# EAGLE design AQS (EAGLE 9.1.3)
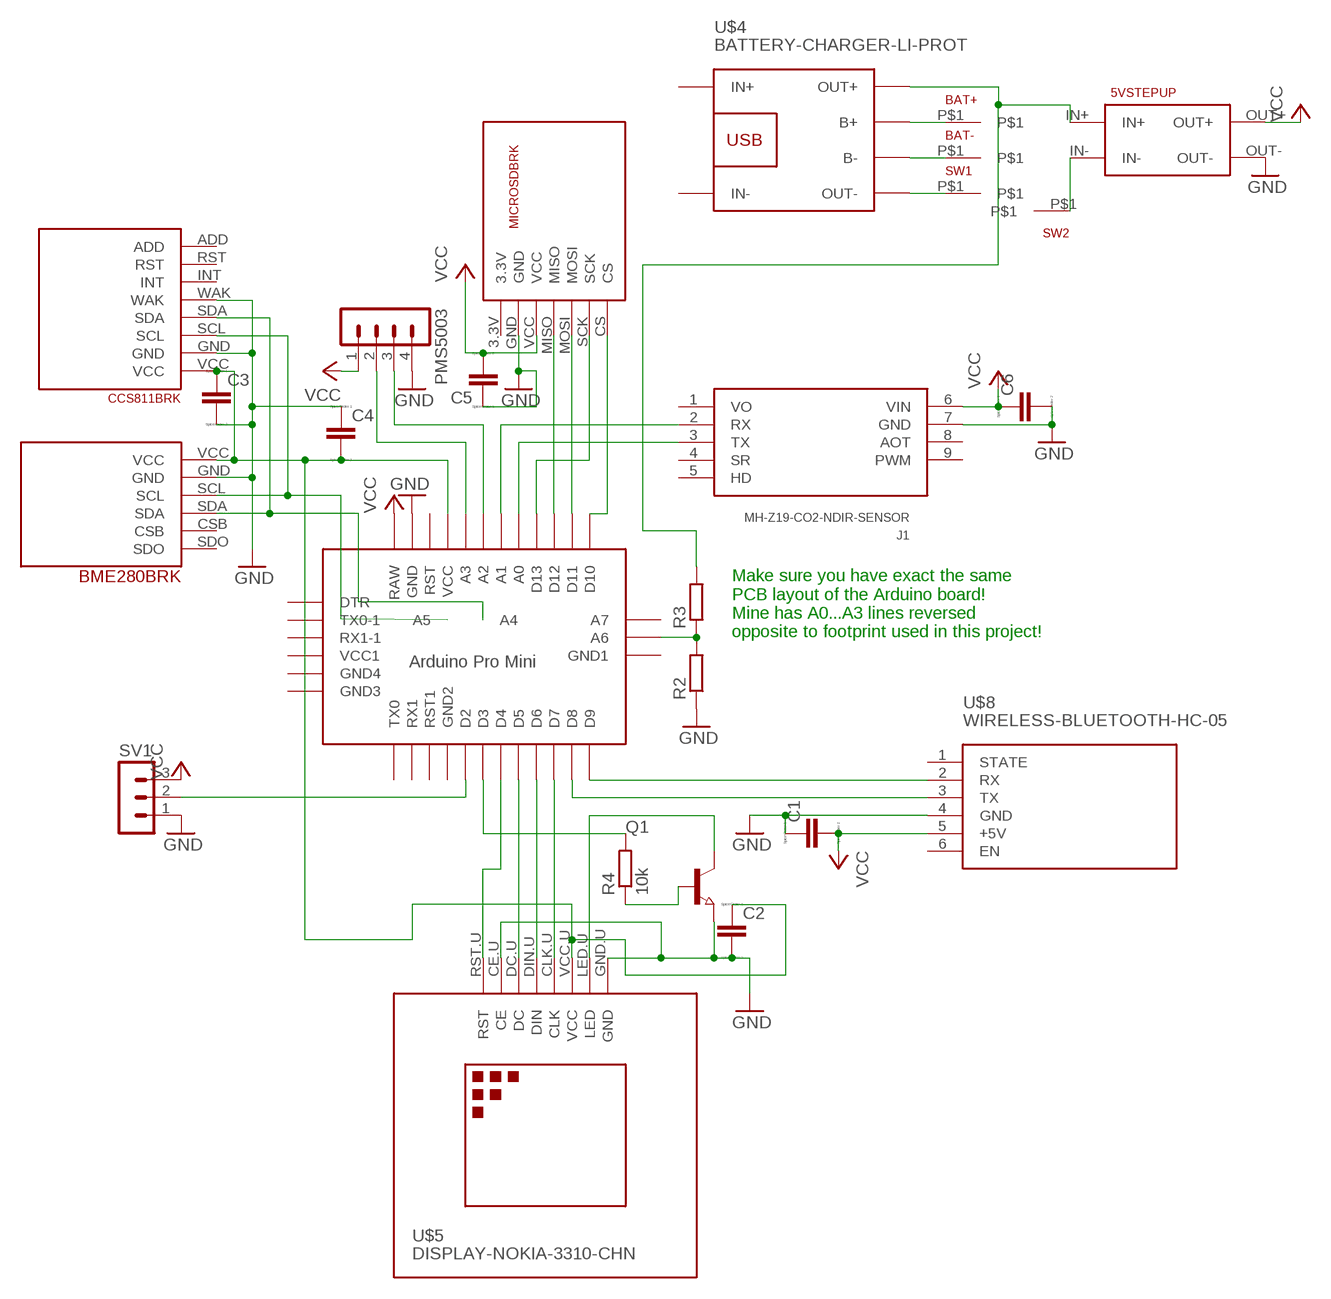
[diagram p0: schematic, sheet 1]

## Parts
BAT+  PIN  [PIN]
BAT-  PIN  [PIN]
C1  CC1206  [C1206]
C2  CC1206  [C1206]
C3  CC1206  [C1206]
C4  CC1206  [C1206]
C5  CC1206  [C1206]
C6  CC1206  [C1206]
J1  MH-Z19-CO2-NDIR-SENSOR  [MH-Z19]
PMS5003  MA04-1  [MA04-1]
Q1  NPN-TRANSISTOR_SOT23  [SOT23]
R2  R-EU_0207/10  [0207/10]
R3  R-EU_0207/10  [0207/10]
R4  10k  R-EU_0207/10  [0207/10]
SV1  MA03-1  [MA03-1]
SW1  PIN  [PIN]
SW2  PIN  [PIN]
U$1  ABK-PRO-MINI  [ABK-PRO-MINI]
U$2  BME280BRK  [BME280BRK]
U$3  5VSTEPUP  [5VSTEPUP]
U$4  BATTERY-CHARGER-LI-PROT  [BATTERY-CHARGER-LI-PROT]
U$5  DISPLAY-NOKIA-3310-CHN  [DISPLAY-NOKIA-3310-CHN]
U$6  CCS811BRK  [CCS811BRK]
U$7  MICROSDBRK  [MICROSDBRK]
U$8  WIRELESS-BLUETOOTH-HC-05  [WIRELESS-BLUETOOTH-HC-05]

## Nets
33V [Power]: C2.1 C3.1 C4.2 U$1.VCC U$2.VCC U$5.VCC.U(VCC) U$6.VCC
GND [Power]: C1.1 C2.2 C3.2 C4.1 C5.1 C6.2 J1.7(GND) PMS5003.4 Q1.2(E) R2.1 SV1.1 U$1.GND U$2.GND U$3.OUT- U$5.CE.U(CE) U$5.GND.U(GND) U$6.GND U$6.WAK U$7.GND U$8.4(GND)
N$1 [Power]: BAT+.P$1 U$4.B+
N$2 [Power]: BAT-.P$1 U$4.B-
N$3: R3.2 U$3.IN+ U$4.OUT+
N$4 [Power]: SW2.P$1 U$3.IN-
N$5 [Signal]: U$1.A4 U$2.SDA U$6.SDA
N$6: U$1.A5 U$2.SCL U$6.SCL
N$7: U$1.D7 U$5.CLK.U(CLK)
N$8: U$1.D6 U$5.DIN.U(DIN)
N$9: U$1.D5 U$5.DC.U(DC)
N$10: U$1.D4 U$5.RST.U(RST)
N$11: Q1.3(C) U$5.LED.U(LED)
N$12: SW1.P$1 U$4.OUT-
N$13: U$1.D9 U$8.2(RX)
N$14: U$1.D10 U$7.CS
N$15: U$1.D11 U$7.MOSI
N$16: U$1.D12 U$7.MISO
N$17: U$1.D13 U$7.SCK
N$18: J1.3(TX) U$1.A0
N$19: J1.2(RX) U$1.A1
N$20: U$1.D8 U$8.3(TX)
N$21: SV1.2 U$1.D2
N$22: PMS5003.3 U$1.A2
N$23: PMS5003.2 U$1.A3
N$24: R2.2 R3.1 U$1.A6
N$25: Q1.1(B) R4.1
N$26: R4.2 U$1.D3
VCC [Power]: C1.2 C5.2 C6.1 J1.6(VIN) PMS5003.1 SV1.3 U$1.RAW U$3.OUT+ U$7.VCC U$8.5(+5V)
Unconnected: J1.4(SR) J1.5(HD) J1.8(AOT) J1.9(PWM) U$1.A7 U$1.DTR U$1.GND1(GND2) U$1.GND2(GND3) U$1.GND3(GND4) U$1.GND4(GND1) U$1.RST U$1.RST1 U$1.RX1 U$1.RX1-1 U$1.TX0 U$1.TX0-1 U$1.VCC1 U$2.CSB U$2.SDO U$4.IN+ U$4.IN- U$6.ADD U$6.INT U$6.RST U$8.1(STATE) U$8.6(EN)

## Notes on the sheet
- Make sure you have exact the same
  PCB layout of the Arduino board! 
  Mine has A0...A3 lines reversed
  opposite to footprint used in this project!

## Power pins joined to a net without a drawn wire
3.3V: U$7.3.3V
VO: J1.1(VO)

## Library data of the parts
BAT+ BAT- SW1 SW2 = AQS:PIN
C1-C6 = eagle-ltspice:C: CAPACITOR, European symbol; SPICEMODEL: NONE; SPICEPREFIX: C
J1 = mg-z19:MH-Z19: MH-Z19 - CO2 NDIR SENSOR
PMS5003 = con-lstb:MA04-1: PIN HEADER; OC_FARNELL: unknown; OC_NEWARK: unknown
Q1 = semicon-smd-ipc:NPN-TRANSISTOR_: NPN TRANSISTOR
R2 R3 = rcl:R-EU_: RESISTOR, European symbol; SPICEPREFIX: R
R4 = resistor:R-EU_: RESISTOR, European symbol
SV1 = con-lstb:MA03-1: PIN HEADER; OC_FARNELL: unknown; OC_NEWARK: unknown
U$1 = ProMini:ABK-PRO-MINI: ABK Pro-Mini Arduino Clone
U$2 = AQS:BME280BRK
U$3 = AQS:5VSTEPUP
U$4 = AQS:BATTERY-CHARGER-LI-PROT: Lithium Battery 5V Charger with protection circuit More details available here: http://www.instructables.com/id/DIY-Lithium-ion-Battery-Charger/step4/TP4056-based-lithium-ion-battery-charger-module/ Click here to find device on ebay.com <http://www.ebay.com/sch/tp4056+charger+usb+protection>
U$5 = AQS:DISPLAY-NOKIA-3310-CHN: 84x48 Dot Matrix LCD Module based on Nokia 3310 display More details available here: https://arduinoandsoftware.wordpress.com/2012/12/30/nokia-33105110-3-3v-display-with-5v-arduino/
U$6 = AQS:CCS811BRK
U$7 = AQS:MICROSDBRK
U$8 = AQS:WIRELESS-BLUETOOTH-HC-05: Bluetooth Transceiver Module based on HC-05 board Tutorial is available here: https://arduino-info.wikispaces.com/BlueTooth-HC05-HC06-Modules-How-To Click here to find device on ebay.com <http://www.ebay.com/sch/hc-05+module+rs232>

## Net classes
0 default: width 0.508 mm
1 Power: width 1.016 mm
2 Signal: width 0.508 mm

## Board
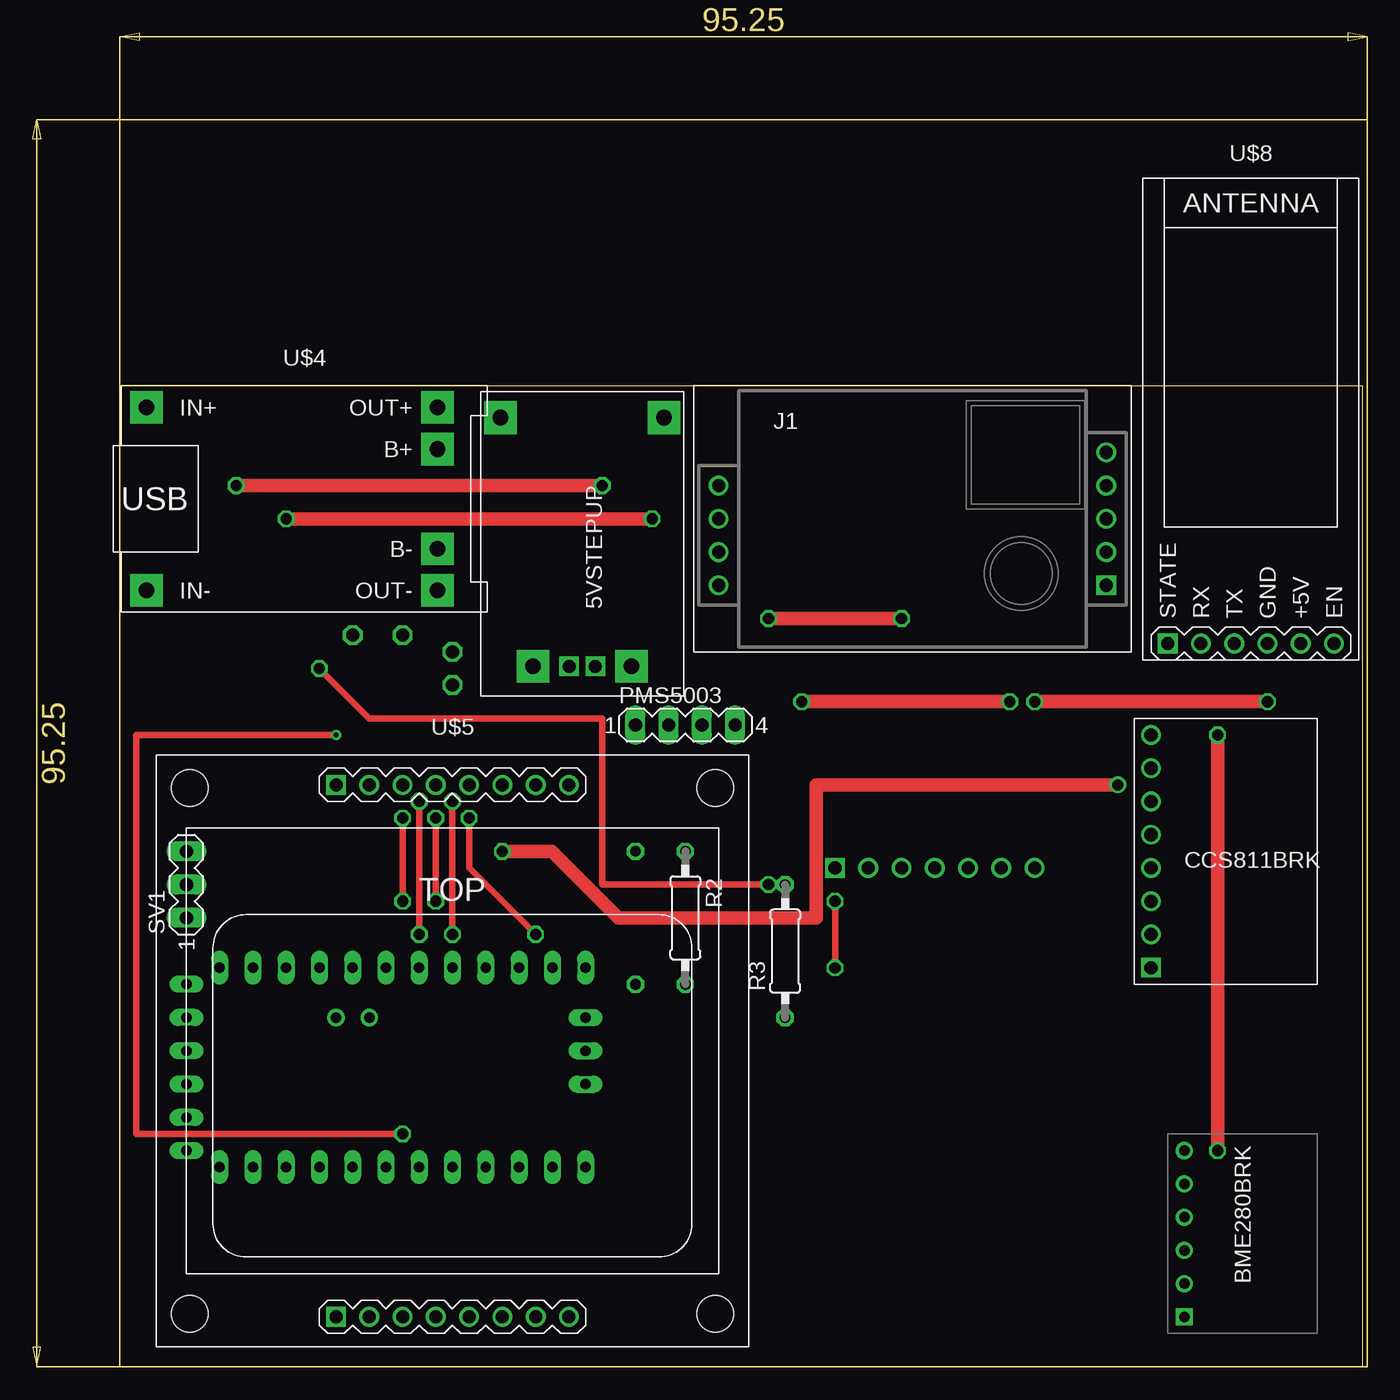
[diagram p1: board, top side]
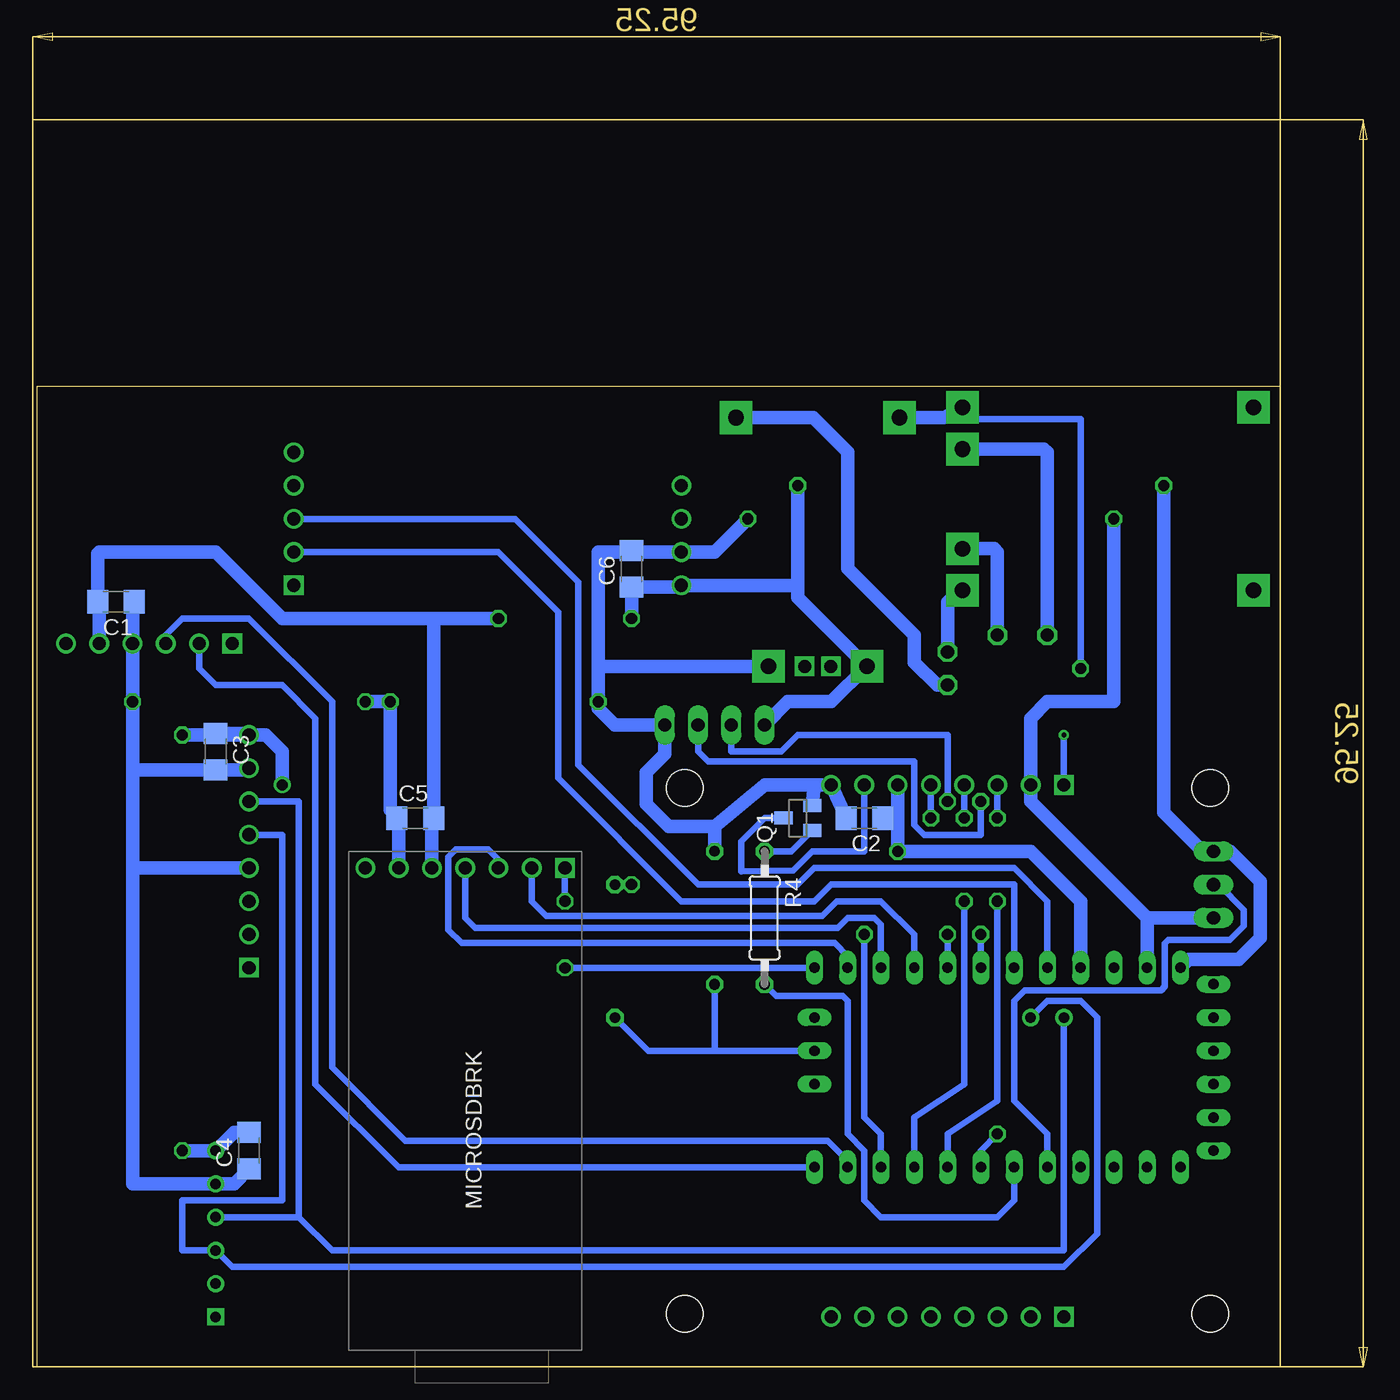
[diagram p2: board, bottom side, seen from below]

Size 94.92 x 74.92 mm. Coordinates in mm from the lower left corner, seen from the top.
Outline: 0,0 94.92,0 94.92,74.92 0,74.92 0,0
Copper layers (1*16): Top 0.035mm / dielectric 1.5mm / Bottom 0.035mm
Design rules "default": minimum track width 6mil, minimum drill 0.35mm, track to track 6mil, track to pad 6mil, pad to pad 6mil, via to via 6mil, smd to smd 6mil, copper to edge 40mil, drill to drill 6mil, minimum pad ring 10mil, minimum via ring 8mil, stop-mask expansion 4mil, vias tented up to drill 0mil, thermal gap 10mil

### Footprints (pad centres in the part's own frame; a part is rotated, then mirrored left to right if it is on the bottom)
PIN = drill 1 octagon: P$1 0,0
C1206 = smd 1.6 x 1.8: 1 -1.4,0; 2 1.4,0
MH-Z19 = drill 1 square: 1 29.591,0 | drill 1: 2 29.591,2.54; 3 29.591,5.08; 4 29.591,7.62; 5 29.591,10.16; 6 0,0; 7 0,2.54; 8 0,5.08; 9 0,7.62
MA04-1 = drill 1.016 long: 1 -3.81,0; 2 -1.27,0; 3 1.27,0; 4 3.81,0
SOT23 = smd 1 x 1.4: 1 -0.95,-1.1; 2 0.95,-1.1; 3 0,1.1
0207/10 = drill 0.813 octagon: 1 -5.08,0; 2 5.08,0
MA03-1 = drill 1.016 long: 1 -2.54,0; 2 0,0; 3 2.54,0
ABK-PRO-MINI = drill 0.8 long: A0 10.16,-3.81; A1 10.16,-6.35; A2 10.16,-8.89; A3 10.16,-11.43; A6 3.81,-21.59; A7 6.35,-21.59; D2 -5.08,-3.81; D3 -5.08,-6.35; D4 -5.08,-8.89; D5 -5.08,-11.43; D6 -5.08,-13.97; D7 -5.08,-16.51; D8 -5.08,-19.05; D9 -5.08,-21.59; D10 10.16,-21.59; D11 10.16,-19.05; D12 10.16,-16.51; D13 10.16,-13.97; DTR 8.89,8.89; GND 10.16,3.81; GND1 -5.08,-1.27; GND2 -3.81,8.89; GND3 -1.27,8.89; GND4 1.27,-21.59; RAW 10.16,6.35; RST 10.16,1.27; RST1 -5.08,1.27; RX1 -5.08,3.81; RX1-1 3.81,8.89; TX0 -5.08,6.35; TX0-1 6.35,8.89; VCC 10.16,-1.27; VCC1 1.27,8.89 | drill 0.8: A4 6.35,-5.08; A5 6.35,-2.54
BME280BRK = drill 0.8: CSB -3.81,3.81; GND 3.81,3.81; SCL 1.27,3.81; SDA -1.27,3.81; VCC 6.35,3.81 | drill 0.8 square: SDO -6.35,3.81
5VSTEPUP = drill 1.194 pad 2.489 square: IN+ -9,-6.5; IN- -9,6; OUT+ 10,-4; OUT- 10,3.5 | drill 0.991 square: P$5 10,0.75; P$6 10,-1.25
BATTERY-CHARGER-LI-PROT = drill 1.2 pad 2.5 square: B+ 10.16,3.81; B- 10.16,-3.81; IN+ -12.065,6.985; IN- -12.065,-6.985; OUT+ 10.16,6.985; OUT- 10.16,-6.985
DISPLAY-NOKIA-3310-CHN = drill 1: CE.D -6.35,-20.32; CE.U -6.35,20.32; CLK.D 1.27,-20.32; CLK.U 1.27,20.32; DC.D -3.81,-20.32; DC.U -3.81,20.32; DIN.D -1.27,-20.32; DIN.U -1.27,20.32; GND.D 8.89,-20.32; GND.U 8.89,20.32; LED.D 6.35,-20.32; LED.U 6.35,20.32; VCC.D 3.81,-20.32; VCC.U 3.81,20.32 | drill 1 square: RST.D -8.89,-20.32; RST.U -8.89,20.32 | hole 2.8: -20.066,-20.066; 20.066,-20.066; 20.066,20.066; -20.066,20.066
CCS811BRK = drill 1 square: ADD -6.35,-8.89 | drill 1: GND -6.35,6.35; INT -6.35,-3.81; RST -6.35,-6.35; SCL -6.35,3.81; SDA -6.35,1.27; VCC -6.35,8.89; WAK -6.35,-1.27
MICROSDBRK = drill 1: 3.3V -16.51,-8.89; GND -16.51,-6.35; MISO -16.51,-1.27; MOSI -16.51,1.27; SCK -16.51,3.81; VCC -16.51,-3.81 | drill 1 square: CS -16.51,6.35
WIRELESS-BLUETOOTH-HC-05 = drill 1 square: 1 -6.35,-17.145 | drill 1: 2 -3.81,-17.145; 3 -1.27,-17.145; 4 1.27,-17.145; 5 3.81,-17.145; 6 6.35,-17.145

### Placement (x,y rotation side)
BAT+  17.78,55.88 0 top
BAT-  21.59,55.88 0 top
C1  88.9,58.42 180 bottom
C2  31.75,41.91 180 bottom
C3  81.28,46.99 270 bottom
C4  78.74,16.51 90 bottom
C5  66.04,41.91 0 bottom
C6  49.53,60.96 90 bottom
J1  45.72,59.69 0 top
PMS5003  43.18,49.02 0 top
Q1  36.83,41.91 90 bottom
R2  43.18,34.29 270 top
R3  50.8,31.75 90 top
R4  39.37,34.29 270 bottom
SV1  5.08,36.83 90 top
SW1  25.4,54.61 0 top
SW2  25.4,52.07 0 top
U$1  13.97,20.32 90 top
U$2  85.09,10.16 90 top
U$3  35.56,63.5 270 top
U$4  14.1,66.29 0 top
U$5  25.4,24.13 0 top
U$6  85.09,39.37 0 top
U$7  60.96,21.59 270 bottom
U$8  86.36,72.39 0 top

### Tracks (layer width: path | path; a pad name or v marks a point on that pad's centre or on a via)
33V  (via drill 0.85)
  Top 1.016: v83.82,48.26 v83.82,16.51 | v29.21,39.37 33,39.37 38.08,34.29 53.2,34.29 53.2,44.45 v76.2,44.45
  Bottom 1.016: C3.1 78.87,48.39 U$6.VCC | U$6.VCC v83.82,48.26 | v83.82,16.51 U$2.VCC 79.88,17.91 C4.2 | U$1.VCC 15.24,35.56 19.05,39.37 v29.21,39.37 29.21,41.91 | 29.21,41.91 U$5.VCC.U | C2.1 29.21,41.91 | U$6.VCC 77.47,48.26 76.2,46.99 v76.2,44.45
GND  (via drill 0.85)
  Top 1.016: v52.07,50.8 v67.94,50.8 | v69.85,50.8 v87.63,50.8 | v12.7,64.77 v40.64,64.77
  Bottom 1.016: 52.07,53.34 v52.07,50.8 52.07,50.29 50.8,49.02 PMS5003.4 46.99,46.81 48.39,45.41 48.39,42.98 46.68,41.27 43.18,41.27 | 52.07,53.34 52.07,62.23 49.53,62.23 | C1.1 87.63,58.29 U$8.4 v87.63,50.8 87.63,45.72 | 78.61,45.59 C3.2 | 78.61,45.59 U$6.GND | 87.63,45.72 87.5,45.59 78.61,45.59 | 87.63,45.72 87.63,38.1 | 87.63,38.1 87.63,13.97 U$2.GND 79.88,13.97 C4.1 | U$6.WAK 87.63,38.1 | 10.16,34.29 U$1.GND | 10.16,34.29 14.61,38.73 19.05,43.18 U$5.CE.U 19.05,49.53 17.78,50.8 12.7,50.8 v12.7,64.77 | 43.18,41.27 39.37,44.45 35.56,44.45 | 35.56,44.45 U$5.GND.U C2.2 | Q1.2 35.56,44.45 | 49.53,62.23 J1.7 43.18,62.23 v40.64,64.77 | 49.53,62.23 C6.2 | 10.16,34.29 SV1.1 | 43.18,41.27 R2.1 | v69.85,50.8 v67.94,50.8 67.94,42.55 C5.1 67.31,41.91 U$7.GND | U$3.OUT- 51.91,53.5 52.07,53.34
N$1
  Bottom 1.016: BAT+.P$1 17.78,69.85 18.03,70.1 U$4.B+
N$2
  Bottom 1.016: BAT-.P$1 21.59,62.23 21.84,62.48 U$4.B-
N$3  (via drill 0.85)
  Top 0.508: v15.24,53.34 19.05,49.53 36.83,49.53 36.83,36.83 v49.53,36.83
  Bottom 0.508: U$4.OUT+ 24,72.39 15.24,72.39 v15.24,53.34 | R3.2 v49.53,36.83
  Bottom 1.016: U$3.IN+ 25.67,72.5 U$4.OUT+
N$4
  Bottom 1.016: U$3.IN- 35.67,72.5 33.02,69.85 33.02,60.96 27.94,55.88 27.94,53.81 26.2,52.07 | 26.2,52.07 | 26.2,52.07 SW2.P$1
N$5
  Bottom 0.508: U$1.A4 17.78,27.94 15.24,27.94 13.97,26.67 13.97,10.16 16.51,7.62 80.01,7.62 U$2.SDA 83.82,8.89 83.82,12.7 76.2,12.7 76.2,40.64 U$6.SDA
N$6
  Bottom 0.508: U$2.SCL 74.93,11.43 | 74.93,11.43 74.93,43.18 U$6.SCL | U$1.A5 16.51,8.89 72.39,8.89 74.93,11.43
N$7  (via drill 0.85)
  Top 0.508: v26.67,41.91 26.67,38.1 v31.75,33.02
  Bottom 0.508: U$1.D7 30.48,17.78 31.75,19.05 v31.75,33.02 | U$5.CLK.U v26.67,41.91
N$8  (via drill 0.85)
  Top 0.508: v24.13,41.91 v24.13,35.56
  Bottom 0.508: U$1.D6 27.94,19.05 24.13,21.59 v24.13,35.56 | U$5.DIN.U v24.13,41.91
N$9  (via drill 0.85, 0.85 pad 0.85)
  Top 0.508: v21.59,41.91 v21.59,35.56
  Bottom 0.508: U$5.DC.U v21.59,41.91 | U$1.D5 25.4,17.78 21.59,20.32 v21.59,35.56
N$10  (via drill 0.35, 0.85)
  Top 0.508: v16.51,48.26 1.27,48.26 1.27,17.78 v21.59,17.78
  Bottom 0.508: U$1.D4 22.86,16.51 v21.59,17.78 | v16.51,48.26 U$5.RST.U
N$11
  Bottom 0.508: U$5.LED.U 31.75,39.37 35.72,39.37 37.16,37.92 41.15,37.84 41.15,40.13 39.37,41.91 Q1.3
N$12
  Bottom 1.016: U$4.OUT- 24.51,59.31 25.4,58.42 SW1.P$1
N$13
  Bottom 0.508: U$1.D9 67.31,15.24 73.66,21.59 73.66,49.53 76.2,52.07 81.28,52.07 82.55,53.34 U$8.2
N$14  (via drill 0.85)
  Top 0.508: v54.61,30.48 v54.61,35.56
  Bottom 0.508: v54.61,30.48 U$1.D10 | U$7.CS v54.61,35.56
N$15
  Bottom 0.508: U$1.D11 33.02,31.36 34.02,32.36 62.5,32.36 63.52,33.37 63.52,38.96 62.97,39.51 60.47,39.51 59.69,38.73 U$7.MOSI
N$16
  Bottom 0.508: U$1.D12 30.48,33.78 30.99,34.29 33.02,34.29 33.78,33.53 61.47,33.53 62.23,34.29 U$7.MISO
N$17
  Bottom 0.508: 27.94,31.75 U$1.D13 27.94,33.02 30.48,35.56 33.86,35.56 34.98,34.44 56.03,34.44 57.15,35.56 U$7.SCK
N$18
  Bottom 0.508: J1.3 58.42,64.77 53.59,59.94 53.59,45.97 44.45,36.83 36.83,36.83 35.56,38.1 20.32,38.1 17.78,35.56 U$1.A0
N$19
  Bottom 0.508: J1.2 59.69,62.23 55.12,57.66 55.12,44.96 45.72,35.56 35.56,35.56 34.29,36.83 20.32,36.83 U$1.A1
N$20
  Bottom 0.508: U$8.3 85.09,55.88 83.82,57.15 78.74,57.15 72.39,50.8 72.39,22.86 66.8,17.27 34.54,17.27 33.02,15.75 U$1.D8
N$21
  Bottom 0.508: U$1.D2 17.78,17.78 20.32,20.32 20.32,27.94 19.49,28.77 9.09,28.77 8.81,29.04 8.81,32.34 8.53,32.61 3.83,32.61 2.77,33.68 2.77,34.9 4.7,36.83 SV1.2
N$22  (via drill 0.85, 0.85 pad 0.85)
  Top 0.508: v22.86,33.02 v22.86,43.18
  Bottom 0.508: U$1.A2 v22.86,33.02 | PMS5003.3 44.45,46.99 43.69,46.23 27.94,46.23 27.94,41.4 27.18,40.64 22.86,40.64 v22.86,43.18
N$23  (via drill 0.85)
  Top 0.508: v25.4,33.02 v25.4,43.18
  Bottom 0.508: U$1.A3 v25.4,33.02 | PMS5003.2 41.91,46.99 38.1,46.99 36.83,48.26 25.4,48.26 v25.4,43.18
N$24
  Bottom 0.508: 43.18,24.13 48.26,24.13 R3.1 | R2.2 43.18,24.13 | U$1.A6 43.18,24.13
N$25
  Bottom 0.508: R4.1 37.34,39.37 37.33,39.36 Q1.1
N$26
  Bottom 0.508: U$1.D3 20.32,12.7 21.59,11.43 30.48,11.43 31.75,12.7 31.75,16.51 33.02,17.78 33.02,27.94 33.4,28.32 38.48,28.32 R4.2
VCC  (via drill 0.85)
  Top 1.016: v36.83,67.31 v8.89,67.31 | v49.53,57.15 v59.69,57.15
  Bottom 1.016: U$8.5 90.17,58.29 C1.2 90.3,62.1 90.17,62.23 81.28,62.23 76.2,57.15 64.64,57.15 | v59.69,57.15 64.64,57.15 | v8.89,67.31 8.89,42.35 5.91,39.37 SV1.3 | SV1.3 5.23,39.52 | SV1.3 3.81,39.37 1.52,37.08 1.52,32.77 3.17,31.11 6.99,31.11 U$1.RAW | 36.83,59.69 36.83,58.77 U$3.OUT+ 34.26,50.8 37.59,50.8 PMS5003.1 | 36.83,59.69 v36.83,67.31 | 36.83,59.69 J1.6 45.85,59.56 C6.1 v49.53,57.15 | U$7.VCC 64.77,41.91 C5.2 64.64,57.15